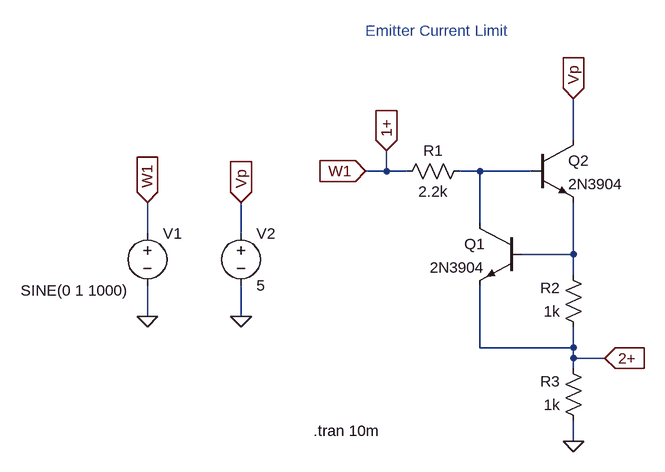
[diagram p0: schematic emit_curr_limit_ltspice.asc]
emit_curr_limit_ltspice.asc, the LTspice schematic file:
Version 4
SHEET 1 916 680
WIRE 256 -208 256 -272
WIRE -32 -160 -32 -192
WIRE -32 -160 -64 -160
WIRE 0 -160 -32 -160
WIRE 112 -160 80 -160
WIRE 192 -160 112 -160
WIRE 112 -80 112 -160
WIRE -400 -64 -400 -112
WIRE -256 -64 -256 -112
WIRE 256 -32 256 -112
WIRE 256 -32 176 -32
WIRE 256 0 256 -32
WIRE -400 64 -400 16
WIRE -256 64 -256 16
WIRE 112 112 112 16
WIRE 256 112 256 80
WIRE 256 112 112 112
WIRE 256 128 256 112
WIRE 304 128 256 128
WIRE 256 144 256 128
WIRE 256 256 256 224
FLAG -400 64 0
FLAG -256 64 0
FLAG -400 -112 W1
IOPIN -400 -112 In
FLAG -256 -112 Vp
IOPIN -256 -112 In
FLAG 256 256 0
FLAG 256 -272 Vp
IOPIN 256 -272 In
FLAG -64 -160 W1
IOPIN -64 -160 In
FLAG -32 -192 1+
IOPIN -32 -192 In
FLAG 304 128 2+
IOPIN 304 128 In
SYMBOL voltage -400 -80 R0
WINDOW 3 -195 104 Left 2
WINDOW 123 0 0 Left 0
WINDOW 39 0 0 Left 0
SYMATTR Value SINE(0 1 1000)
SYMATTR InstName V1
SYMBOL voltage -256 -80 R0
WINDOW 123 0 0 Left 0
WINDOW 39 0 0 Left 0
SYMATTR InstName V2
SYMATTR Value 5
SYMBOL res 96 -176 R90
WINDOW 0 0 56 VBottom 2
WINDOW 3 32 56 VTop 2
SYMATTR InstName R1
SYMATTR Value 2.2k
SYMBOL res 272 96 R180
WINDOW 0 36 76 Left 2
WINDOW 3 36 40 Left 2
SYMATTR InstName R2
SYMATTR Value 1k
SYMBOL res 272 240 R180
WINDOW 0 36 76 Left 2
WINDOW 3 36 40 Left 2
SYMATTR InstName R3
SYMATTR Value 1k
SYMBOL npn 176 -80 M0
SYMATTR InstName Q1
SYMATTR Value 2N3904
SYMBOL npn 192 -208 R0
SYMATTR InstName Q2
SYMATTR Value 2N3904
TEXT -144 240 Left 2 !.tran 10m
TEXT -64 -376 Left 2 ;Emitter Current Limit

The netlist it stands for:
* emit_curr_limit_ltspice.asc
V1 1+ 0 SINE(0 1 1000)
V2 Vp 0 5
R1 N001 1+ 2.2k
R2 2+ N002 1k
R3 0 2+ 1k
Q1 N001 N002 2+ 0 2N3904
Q2 Vp N001 N002 0 2N3904
.model NPN NPN
.model PNP PNP
.lib standard.bjt
.tran 10m
* Emitter Current Limit
.backanno
.end